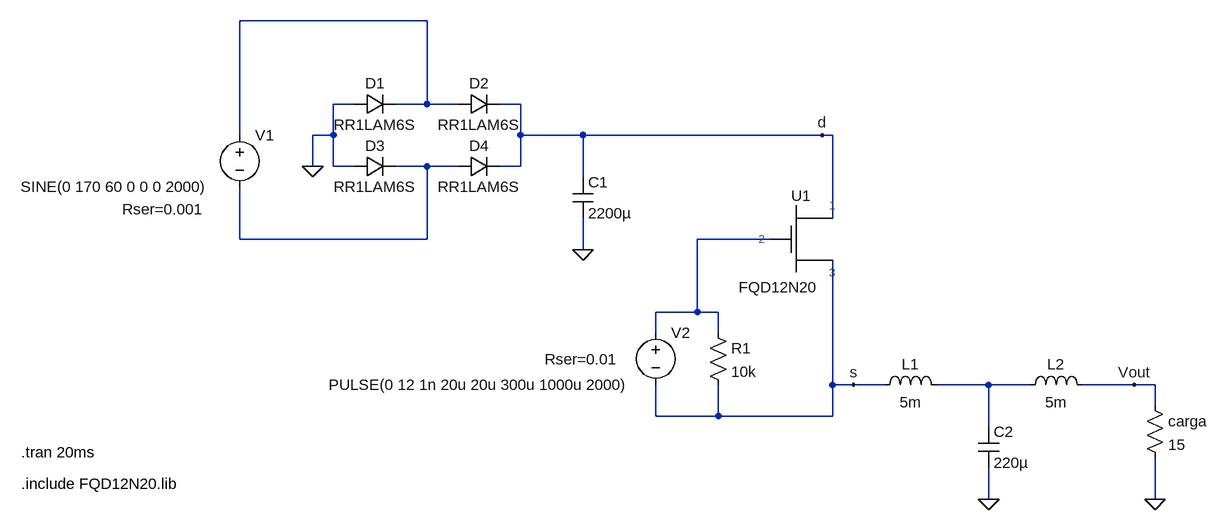
[diagram p0: schematic main.asc]
main.asc, the LTspice schematic file:
Version 4
SHEET 1 1448 724
WIRE 240 -32 -48 -32
WIRE 128 96 96 96
WIRE 240 96 240 -32
WIRE 240 96 192 96
WIRE 288 96 240 96
WIRE 384 96 352 96
WIRE -48 144 -48 -32
WIRE 96 144 96 96
WIRE 96 144 64 144
WIRE 384 144 384 96
WIRE 480 144 384 144
WIRE 848 144 480 144
WIRE 864 144 848 144
WIRE 64 192 64 144
WIRE 96 192 96 144
WIRE 128 192 96 192
WIRE 240 192 192 192
WIRE 288 192 240 192
WIRE 384 192 384 144
WIRE 384 192 352 192
WIRE 480 208 480 144
WIRE 864 272 864 144
WIRE -48 304 -48 224
WIRE 240 304 240 192
WIRE 240 304 -48 304
WIRE 768 304 656 304
WIRE 480 320 480 272
WIRE 656 416 656 304
WIRE 656 416 592 416
WIRE 688 416 656 416
WIRE 592 448 592 416
WIRE 688 448 688 416
WIRE 864 528 864 336
WIRE 896 528 864 528
WIRE 944 528 896 528
WIRE 1104 528 1024 528
WIRE 1168 528 1104 528
WIRE 1328 528 1248 528
WIRE 1360 528 1328 528
WIRE 1360 560 1360 528
WIRE 592 576 592 528
WIRE 688 576 688 528
WIRE 688 576 592 576
WIRE 864 576 864 528
WIRE 864 576 688 576
WIRE 1104 592 1104 528
WIRE 1104 704 1104 656
WIRE 1360 704 1360 640
FLAG 64 192 0
FLAG 480 320 0
FLAG 1104 704 0
FLAG 1360 704 0
FLAG 1328 528 Vout
FLAG 848 144 d
FLAG 896 528 s
SYMBOL voltage -48 128 R0
WINDOW 3 -337 95 Left 2
WINDOW 123 0 0 Left 0
WINDOW 39 -181 130 Left 2
SYMATTR Value SINE(0 170 60 0 0 0 2000)
SYMATTR SpiceLine Rser=0.001
SYMATTR InstName V1
SYMBOL diode 128 112 R270
WINDOW 0 32 32 VTop 2
WINDOW 3 0 32 VBottom 2
SYMATTR InstName D1
SYMATTR Value RR1LAM6S
SYMBOL diode 288 112 R270
WINDOW 0 32 32 VTop 2
WINDOW 3 0 32 VBottom 2
SYMATTR InstName D2
SYMATTR Value RR1LAM6S
SYMBOL cap 464 208 R0
SYMATTR InstName C1
SYMATTR Value 2200µ
SYMATTR SpiceLine Rser=0.001 Rpar=10Meg
SYMBOL ind 928 544 R270
WINDOW 0 32 56 VTop 2
WINDOW 3 5 56 VBottom 2
SYMATTR InstName L1
SYMATTR Value 5m
SYMATTR SpiceLine Rser=.02 Rpar=1Meg
SYMBOL cap 1088 592 R0
SYMATTR InstName C2
SYMATTR Value 220µ
SYMATTR SpiceLine Rpar=10Meg
SYMBOL res 1344 544 R0
SYMATTR InstName carga
SYMATTR Value 15
SYMBOL voltage 592 432 R0
WINDOW 3 -503 96 Left 2
WINDOW 123 0 0 Left 0
WINDOW 39 -171 57 Left 2
SYMATTR Value PULSE(0 12 1n 20u 20u 300u 1000u 2000)
SYMATTR SpiceLine Rser=0.01
SYMATTR InstName V2
SYMBOL diode 128 208 R270
WINDOW 0 32 32 VTop 2
WINDOW 3 0 32 VBottom 2
SYMATTR InstName D3
SYMATTR Value RR1LAM6S
SYMBOL diode 288 208 R270
WINDOW 0 32 32 VTop 2
WINDOW 3 0 32 VBottom 2
SYMATTR InstName D4
SYMATTR Value RR1LAM6S
SYMBOL ind 1152 544 R270
WINDOW 0 32 56 VTop 2
WINDOW 3 5 56 VBottom 2
SYMATTR InstName L2
SYMATTR Value 5m
SYMATTR SpiceLine Rser=.02 Rpar=1Meg
SYMBOL res 672 432 R0
SYMATTR InstName R1
SYMATTR Value 10k
SYMBOL AutoGenerated\\mosfet 816 304 R0
SYMATTR InstName U1
SYMATTR Value FQD12N20
TEXT -384 632 Left 2 !.tran 20ms
TEXT -384 680 Left 2 !.include FQD12N20.lib

The netlist it stands for:
* main.asc
V1 N001 N002 SINE(0 170 60 0 0 0 2000) Rser=0.001
D1 0 N001 RR1LAM6S
D2 N001 d RR1LAM6S
C1 d 0 2200µ Rser=0.001 Rpar=10Meg
L1 s N004 5m Rser=.02 Rpar=1Meg
C2 N004 0 220µ Rpar=10Meg
R§carga Vout 0 15
V2 N003 s PULSE(0 12 1n 20u 20u 300u 1000u 2000) Rser=0.01
D3 0 N002 RR1LAM6S
D4 N002 d RR1LAM6S
L2 N004 Vout 5m Rser=.02 Rpar=1Meg
R1 N003 s 10k
XU1 d N003 s FQD12N20  ; pins 1 2 3
.model D D
.lib standard.dio
.tran 20ms
.include FQD12N20.lib
.lib C:\Users\Raul Alzate\Desktop\Tentactil\Circuits_Electronics\Regulador5V\irf8010pbf.spi
.backanno
.end

* Results of the author's LTspice run, read from the files saved beside the schematic
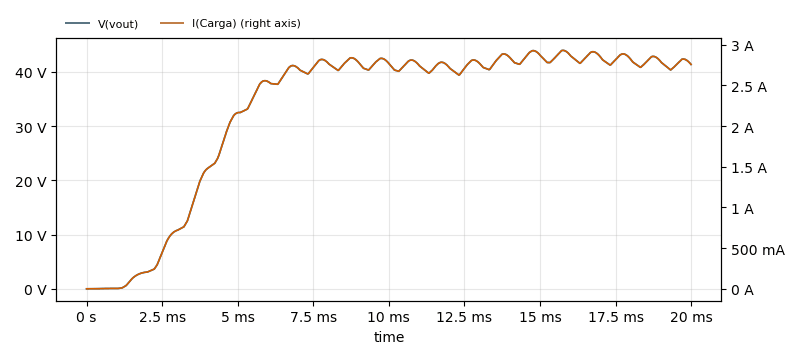
[diagram p1: Transient Analysis of main.asc, plotted from the saved traces]
* Transient Analysis, 1 run:
*   V(vout): min -36.85 µV, max 43.98 V, average 33.43 V, rms 36.42 V, last 41.38 V
*   I(Carga): min -2.457 µA, max 2.932 A, average 2.228 A, rms 2.428 A, last 2.758 A